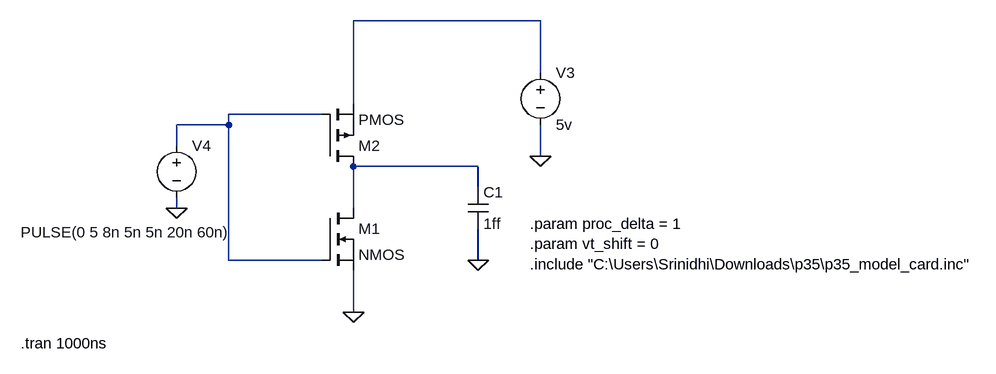
[diagram p0: schematic P35_CMOS.asc]
P35_CMOS.asc, the LTspice schematic file:
Version 4
SHEET 1 2100 804
WIRE 560 -128 272 -128
WIRE 560 -48 560 -128
WIRE 272 0 272 -128
WIRE 224 16 80 16
WIRE 80 32 80 16
WIRE 80 32 0 32
WIRE 0 64 0 32
WIRE 560 80 560 32
WIRE 464 96 272 96
WIRE 464 128 464 96
WIRE 0 160 0 144
WIRE 272 160 272 96
WIRE 80 240 80 32
WIRE 224 240 80 240
WIRE 464 240 464 192
WIRE 272 320 272 256
FLAG 0 160 0
FLAG 560 80 0
FLAG 464 240 0
FLAG 272 320 0
SYMBOL nmos 224 160 R0
SYMATTR InstName M1
SYMBOL pmos 224 96 M180
SYMATTR InstName M2
SYMBOL cap 448 128 R0
SYMATTR InstName C1
SYMATTR Value 1ff
SYMBOL voltage 560 -64 R0
WINDOW 123 0 0 Left 0
WINDOW 39 0 0 Left 0
SYMATTR InstName V3
SYMATTR Value 5v
SYMBOL voltage 0 48 R0
WINDOW 3 -240 149 Left 2
WINDOW 123 0 0 Left 0
WINDOW 39 0 0 Left 0
SYMATTR Value PULSE(0 5 8n 5n 5n 20n 60n)
SYMATTR InstName V4
TEXT 544 184 Left 2 !.param proc_delta = 1\n.param vt_shift = 0\n.include "C:\\Users\\Srinidhi\\Downloads\\p35\\p35_model_card.inc"
TEXT -240 368 Left 2 !.tran 1000ns

The netlist it stands for:
* P35_CMOS.asc
M1 N003 N002 0 0 NMOS
M2 N003 N002 N001 N001 PMOS
C1 N003 0 1ff
V3 N001 0 5v
V4 N002 0 PULSE(0 5 8n 5n 5n 20n 60n)
.model NMOS NMOS
.model PMOS PMOS
.lib standard.mos
.param proc_delta = 1
.param vt_shift = 0
.include "C:\Users\Srinidhi\Downloads\p35\p35_model_card.inc"
.tran 1000ns
.backanno
.end